# Altium schematic sheet Header.SchDoc
size A4; SheetNumber: 1; SheetTotal: 6
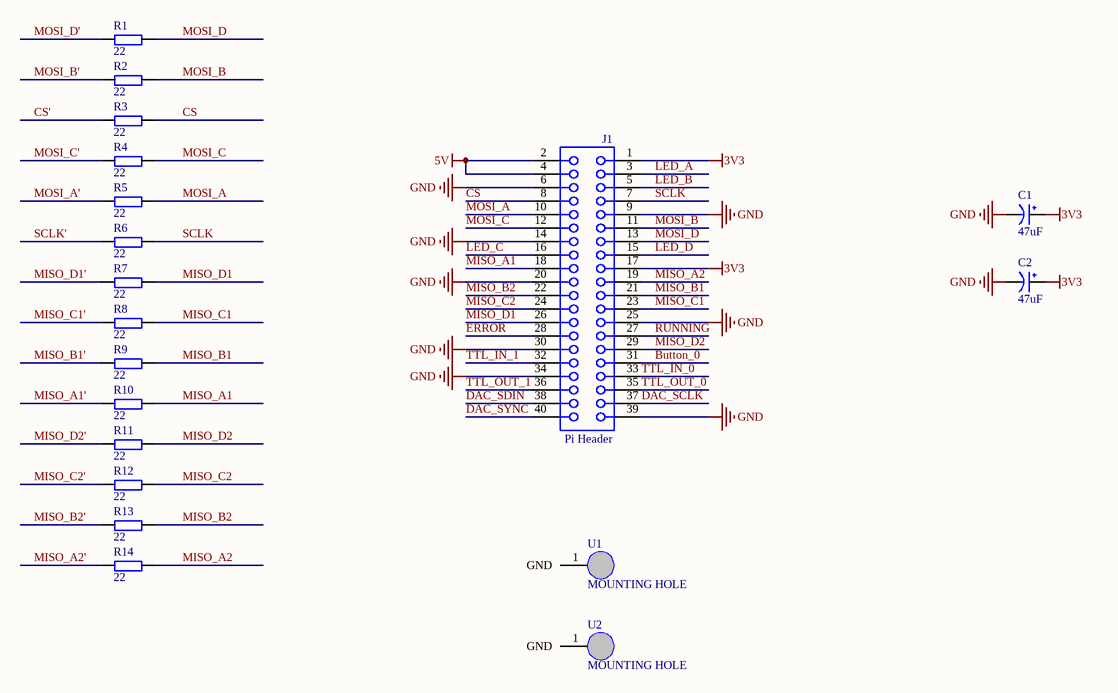
[diagram p0: Header.SchDoc]

## Parts
C1  47uF  [CD A(3216)]
C2  47uF  [CD A(3216)]
J1  Pi Header  [61304021821]
R1  22  [R 0402_L]
R2  22  [R 0402_L]
R3  22  [R 0402_L]
R4  22  [R 0402_L]
R5  22  [R 0402_L]
R6  22  [R 0402_L]
R7  22  [R 0402_L]
R8  22  [R 0402_L]
R9  22  [R 0402_L]
R10  22  [R 0402_L]
R11  22  [R 0402_L]
R12  22  [R 0402_L]
R13  22  [R 0402_L]
R14  22  [R 0402_L]
U1  MOUNTING HOLE  [mounting_hole]
U2  MOUNTING HOLE  [mounting_hole]

## Nets
3V3: C1.1(VCC) C2.1(VCC) J1.1 J1.17
5V: J1.2 J1.4
GND: C1.2(GND) C2.2(GND) J1.6 J1.9 J1.14 J1.20 J1.25 J1.30 J1.34 J1.39
Button_0: J1.31
CS: J1.8 R3.2
CS': R3.1
DAC_SCLK: J1.37
DAC_SDIN: J1.38
DAC_SYNC: J1.40
ERROR: J1.28
LED_A: J1.3
LED_B: J1.5
LED_C: J1.16
LED_D: J1.15
MISO_A1: J1.18 R10.2
MISO_A1': R10.1
MISO_A2: J1.19 R14.2
MISO_A2': R14.1
MISO_B1: J1.21 R9.2
MISO_B1': R9.1
MISO_B2: J1.22 R13.2
MISO_B2': R13.1
MISO_C1: J1.23 R8.2
MISO_C1': R8.1
MISO_C2: J1.24 R12.2
MISO_C2': R12.1
MISO_D1: J1.26 R7.2
MISO_D1': R7.1
MISO_D2: J1.29 R11.2
MISO_D2': R11.1
MOSI_A: J1.10 R5.2
MOSI_A': R5.1
MOSI_B: J1.11 R2.2
MOSI_B': R2.1
MOSI_C: J1.12 R4.2
MOSI_C': R4.1
MOSI_D: J1.13 R1.2
MOSI_D': R1.1
RUNNING: J1.27
SCLK: J1.7 R6.2
SCLK': R6.1
TTL_IN_0: J1.33
TTL_IN_1: J1.32
TTL_OUT_0: J1.35
TTL_OUT_1: J1.36

Not connected (* = marked no-connect by the designer): U1 1(GND); U2 1(GND)

## Library data of the parts
C1 C2 = CAP
J1 = CMP-1502-01370-4: THT Vertical Socket Header WR-PHD, Pitch 2.54 mm, Dual Row, 40 pins; Current Rating: 3A; Contact Resistance: 20mΩ; Gender: Female; Operating Supply Voltage: 250V; Lead Pitch: 2.54mm; Orientation: Vertical; Number of Pins: 40
R1-R14 = R
U1 U2 = MountingHole: Part Number: VJ0805Y105KXQRW1BC; Manufacturer: Vitramon